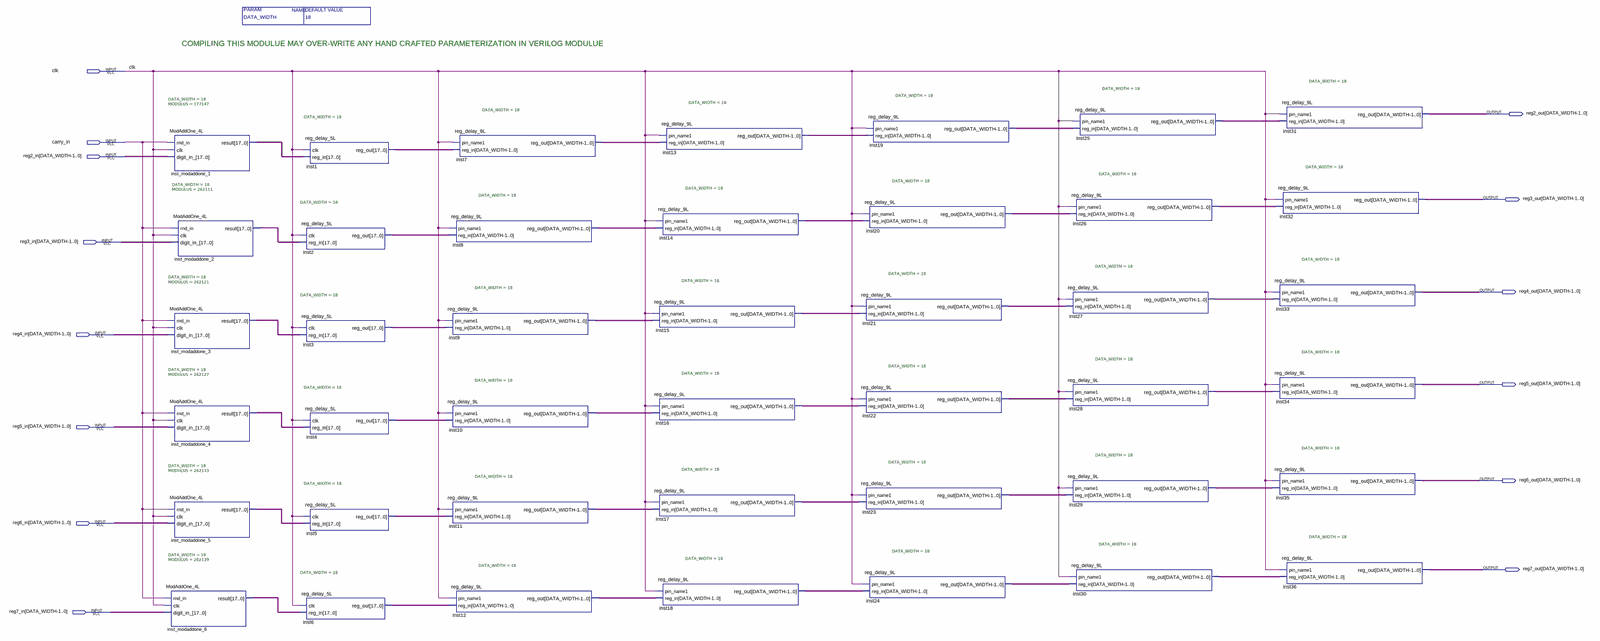
[diagram p0: schematic sheet, whole]
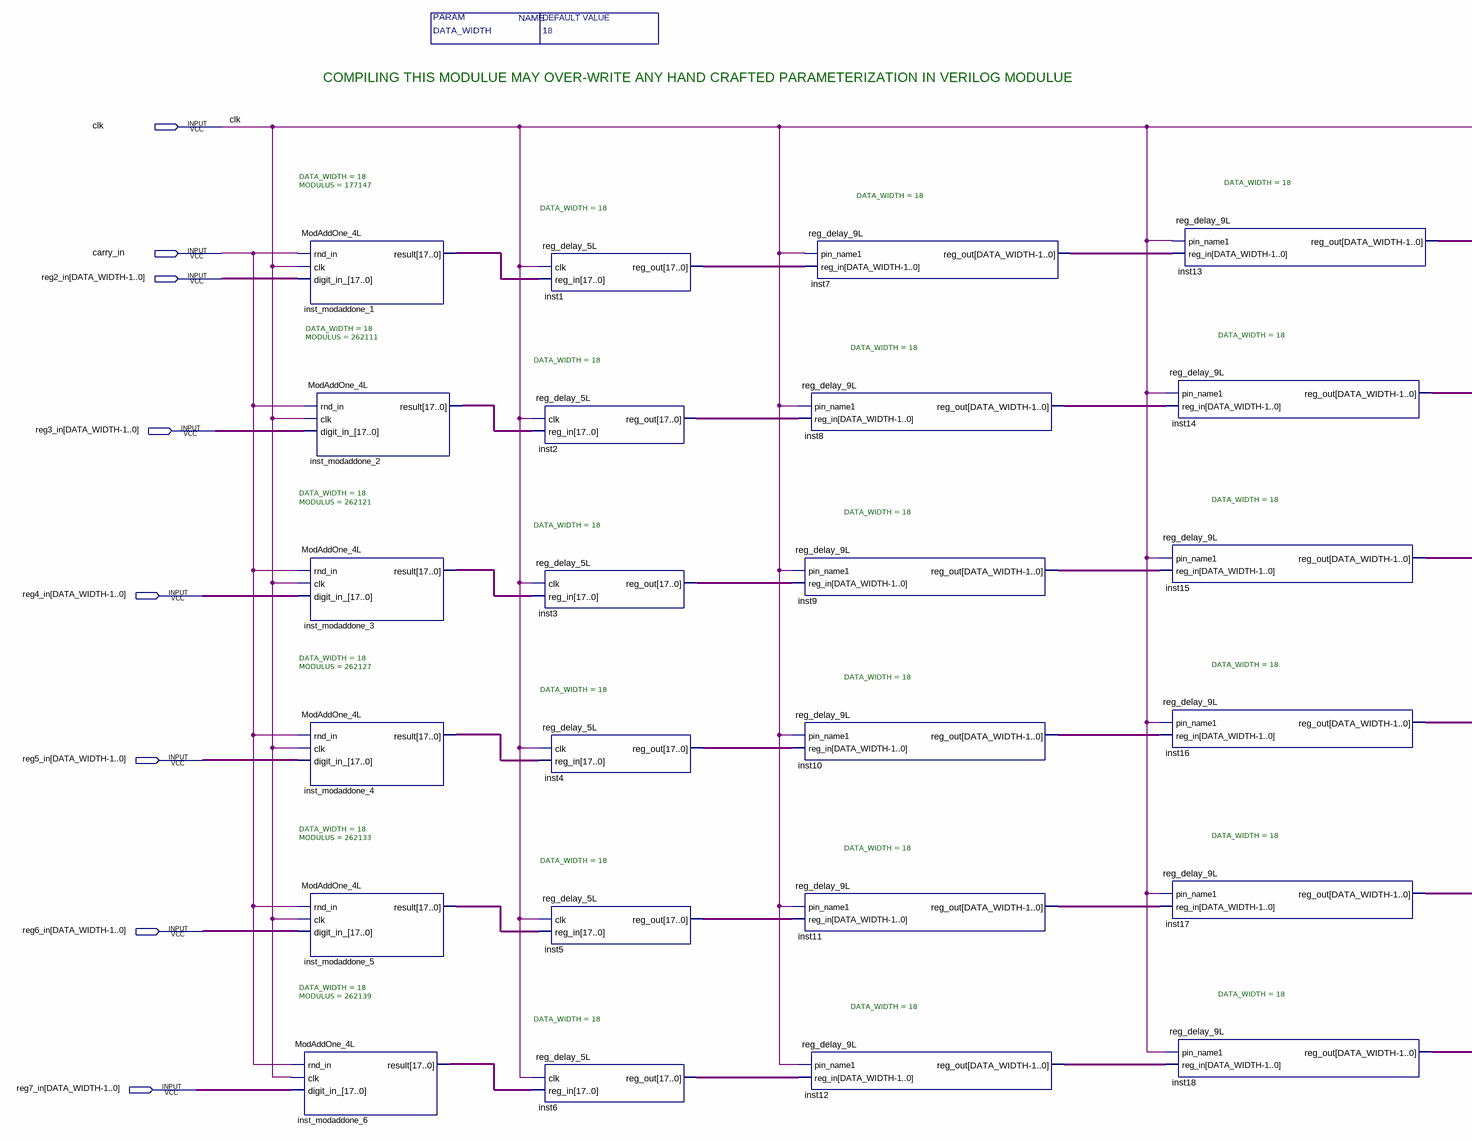
[diagram p1: schematic sheet, left part]
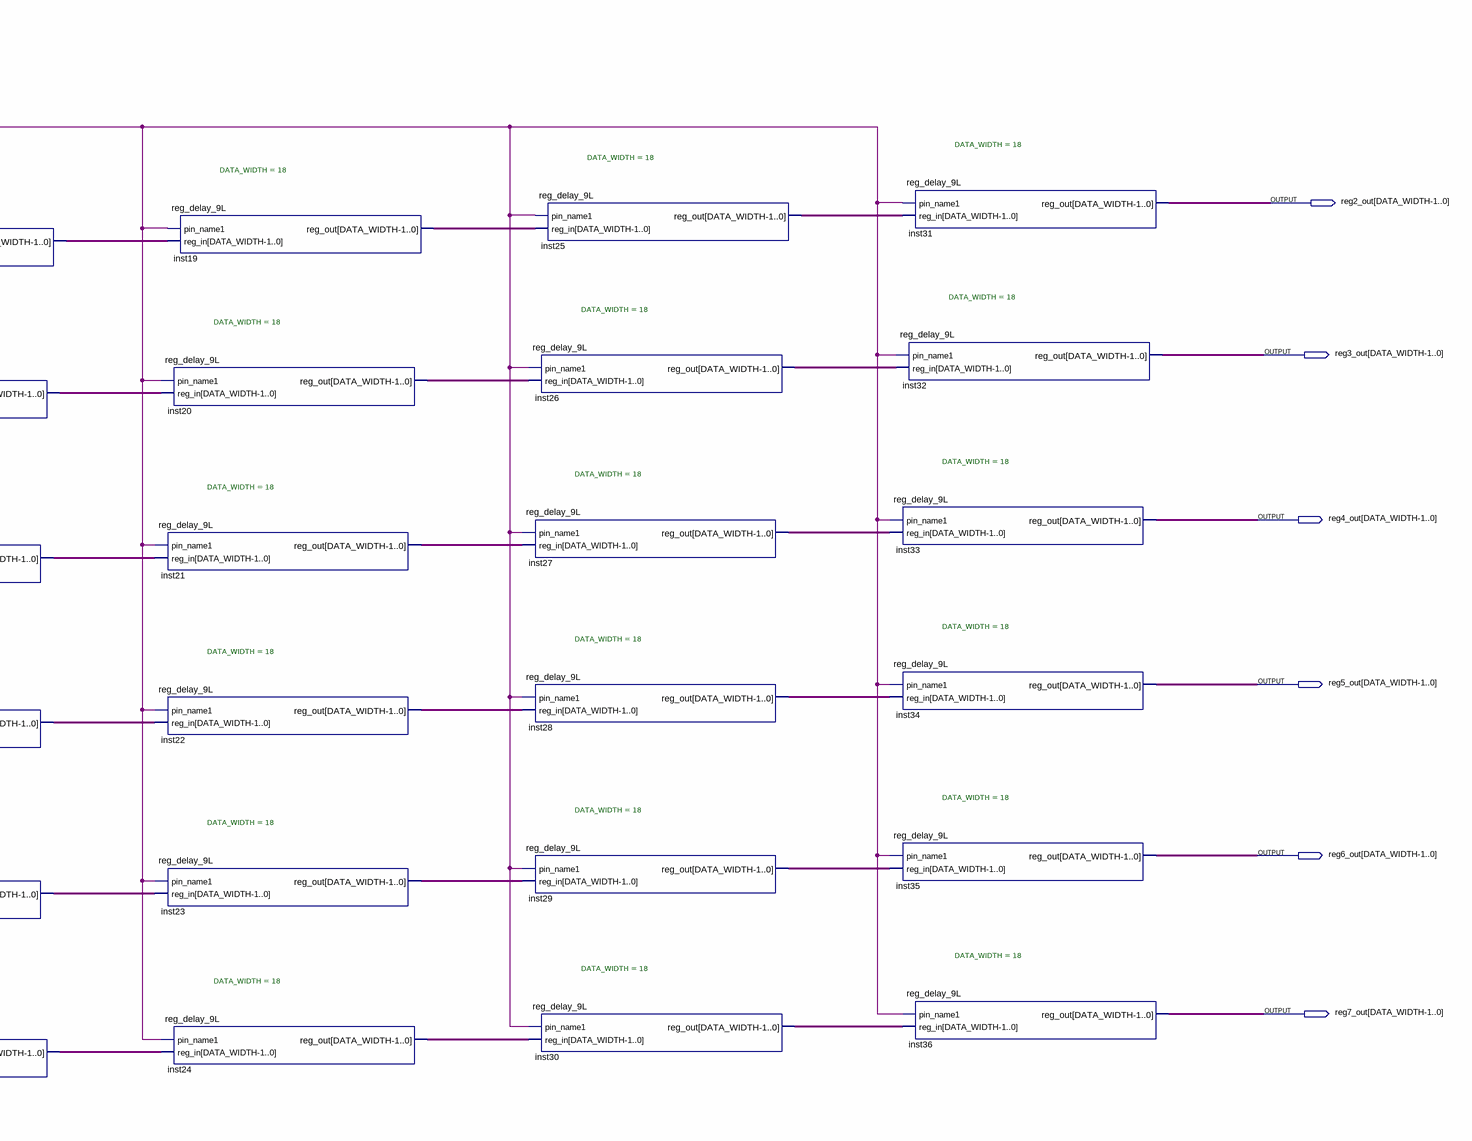
[diagram p2: schematic sheet, right part]
// Quartus schematic reg_delay_addone_9L_x6.bdf as structural Verilog: 42 symbols, 14 pins
module reg_delay_addone_9L_x6 #(parameter DATA_WIDTH = 18) (
  input  clk,
  input  carry_in,
  input  [17:0] reg2_in,
  input  [17:0] reg3_in,
  input  [17:0] reg4_in,
  input  [17:0] reg5_in,
  input  [17:0] reg6_in,
  input  [17:0] reg7_in,
  output [17:0] reg2_out,
  output [17:0] reg3_out,
  output [17:0] reg4_out,
  output [17:0] reg5_out,
  output [17:0] reg6_out,
  output [17:0] reg7_out
);

  wire [17:0] inst1_reg_out, inst2_reg_out, inst3_reg_out, inst4_reg_out, inst5_reg_out, inst6_reg_out,
       inst7_reg_out, inst8_reg_out, inst9_reg_out, inst10_reg_out, inst11_reg_out, inst12_reg_out,
       inst13_reg_out, inst14_reg_out, inst15_reg_out, inst16_reg_out, inst17_reg_out, inst18_reg_out,
       inst19_reg_out, inst20_reg_out, inst21_reg_out, inst22_reg_out, inst23_reg_out, inst24_reg_out,
       inst25_reg_out, inst26_reg_out, inst27_reg_out, inst28_reg_out, inst29_reg_out, inst30_reg_out,
       inst_modaddone_1_result, inst_modaddone_2_result, inst_modaddone_3_result, inst_modaddone_4_result,
       inst_modaddone_5_result, inst_modaddone_6_result;

  ModAddOne_4L #(.DATA_WIDTH(18), .MODULUS(177147)) inst_modaddone_1 (
    .rnd_in(carry_in), .clk(clk), .digit_in_(reg2_in), .result(inst_modaddone_1_result));
  ModAddOne_4L #(.DATA_WIDTH(18), .MODULUS(262111)) inst_modaddone_2 (
    .rnd_in(carry_in), .clk(clk), .digit_in_(reg3_in), .result(inst_modaddone_2_result));
  ModAddOne_4L #(.DATA_WIDTH(18), .MODULUS(262121)) inst_modaddone_3 (
    .rnd_in(carry_in), .clk(clk), .digit_in_(reg4_in), .result(inst_modaddone_3_result));
  ModAddOne_4L #(.DATA_WIDTH(18), .MODULUS(262127)) inst_modaddone_4 (
    .rnd_in(carry_in), .clk(clk), .digit_in_(reg5_in), .result(inst_modaddone_4_result));
  ModAddOne_4L #(.DATA_WIDTH(18), .MODULUS(262133)) inst_modaddone_5 (
    .rnd_in(carry_in), .clk(clk), .digit_in_(reg6_in), .result(inst_modaddone_5_result));
  ModAddOne_4L #(.DATA_WIDTH(18), .MODULUS(262139)) inst_modaddone_6 (
    .rnd_in(carry_in), .clk(clk), .digit_in_(reg7_in), .result(inst_modaddone_6_result));
  reg_delay_5L #(.DATA_WIDTH(18)) inst1 (.clk(clk), .reg_in(inst_modaddone_1_result), .reg_out(inst1_reg_out));
  reg_delay_5L #(.DATA_WIDTH(18)) inst2 (.clk(clk), .reg_in(inst_modaddone_2_result), .reg_out(inst2_reg_out));
  reg_delay_5L #(.DATA_WIDTH(18)) inst3 (.clk(clk), .reg_in(inst_modaddone_3_result), .reg_out(inst3_reg_out));
  reg_delay_5L #(.DATA_WIDTH(18)) inst4 (.clk(clk), .reg_in(inst_modaddone_4_result), .reg_out(inst4_reg_out));
  reg_delay_5L #(.DATA_WIDTH(18)) inst5 (.clk(clk), .reg_in(inst_modaddone_5_result), .reg_out(inst5_reg_out));
  reg_delay_5L #(.DATA_WIDTH(18)) inst6 (.clk(clk), .reg_in(inst_modaddone_6_result), .reg_out(inst6_reg_out));
  reg_delay_9L #(.DATA_WIDTH(18)) inst7 (.pin_name1(clk), .reg_in(inst1_reg_out), .reg_out(inst7_reg_out));
  reg_delay_9L #(.DATA_WIDTH(18)) inst8 (.pin_name1(clk), .reg_in(inst2_reg_out), .reg_out(inst8_reg_out));
  reg_delay_9L #(.DATA_WIDTH(18)) inst9 (.pin_name1(clk), .reg_in(inst3_reg_out), .reg_out(inst9_reg_out));
  reg_delay_9L #(.DATA_WIDTH(18)) inst10 (.pin_name1(clk), .reg_in(inst4_reg_out), .reg_out(inst10_reg_out));
  reg_delay_9L #(.DATA_WIDTH(18)) inst11 (.pin_name1(clk), .reg_in(inst5_reg_out), .reg_out(inst11_reg_out));
  reg_delay_9L #(.DATA_WIDTH(18)) inst12 (.pin_name1(clk), .reg_in(inst6_reg_out), .reg_out(inst12_reg_out));
  reg_delay_9L #(.DATA_WIDTH(18)) inst14 (.pin_name1(clk), .reg_in(inst8_reg_out), .reg_out(inst14_reg_out));
  reg_delay_9L #(.DATA_WIDTH(18)) inst15 (.pin_name1(clk), .reg_in(inst9_reg_out), .reg_out(inst15_reg_out));
  reg_delay_9L #(.DATA_WIDTH(18)) inst16 (.pin_name1(clk), .reg_in(inst10_reg_out), .reg_out(inst16_reg_out));
  reg_delay_9L #(.DATA_WIDTH(18)) inst17 (.pin_name1(clk), .reg_in(inst11_reg_out), .reg_out(inst17_reg_out));
  reg_delay_9L #(.DATA_WIDTH(18)) inst18 (.pin_name1(clk), .reg_in(inst12_reg_out), .reg_out(inst18_reg_out));
  reg_delay_9L #(.DATA_WIDTH(18)) inst13 (.pin_name1(clk), .reg_in(inst7_reg_out), .reg_out(inst13_reg_out));
  reg_delay_9L #(.DATA_WIDTH(18)) inst19 (.pin_name1(clk), .reg_in(inst13_reg_out), .reg_out(inst19_reg_out));
  reg_delay_9L #(.DATA_WIDTH(18)) inst20 (.pin_name1(clk), .reg_in(inst14_reg_out), .reg_out(inst20_reg_out));
  reg_delay_9L #(.DATA_WIDTH(18)) inst21 (.pin_name1(clk), .reg_in(inst15_reg_out), .reg_out(inst21_reg_out));
  reg_delay_9L #(.DATA_WIDTH(18)) inst22 (.pin_name1(clk), .reg_in(inst16_reg_out), .reg_out(inst22_reg_out));
  reg_delay_9L #(.DATA_WIDTH(18)) inst23 (.pin_name1(clk), .reg_in(inst17_reg_out), .reg_out(inst23_reg_out));
  reg_delay_9L #(.DATA_WIDTH(18)) inst24 (.pin_name1(clk), .reg_in(inst18_reg_out), .reg_out(inst24_reg_out));
  reg_delay_9L #(.DATA_WIDTH(18)) inst25 (.pin_name1(clk), .reg_in(inst19_reg_out), .reg_out(inst25_reg_out));
  reg_delay_9L #(.DATA_WIDTH(18)) inst26 (.pin_name1(clk), .reg_in(inst20_reg_out), .reg_out(inst26_reg_out));
  reg_delay_9L #(.DATA_WIDTH(18)) inst27 (.pin_name1(clk), .reg_in(inst21_reg_out), .reg_out(inst27_reg_out));
  reg_delay_9L #(.DATA_WIDTH(18)) inst28 (.pin_name1(clk), .reg_in(inst22_reg_out), .reg_out(inst28_reg_out));
  reg_delay_9L #(.DATA_WIDTH(18)) inst29 (.pin_name1(clk), .reg_in(inst23_reg_out), .reg_out(inst29_reg_out));
  reg_delay_9L #(.DATA_WIDTH(18)) inst30 (.pin_name1(clk), .reg_in(inst24_reg_out), .reg_out(inst30_reg_out));
  reg_delay_9L #(.DATA_WIDTH(18)) inst31 (.pin_name1(clk), .reg_in(inst25_reg_out), .reg_out(reg2_out));
  reg_delay_9L #(.DATA_WIDTH(18)) inst32 (.pin_name1(clk), .reg_in(inst26_reg_out), .reg_out(reg3_out));
  reg_delay_9L #(.DATA_WIDTH(18)) inst33 (.pin_name1(clk), .reg_in(inst27_reg_out), .reg_out(reg4_out));
  reg_delay_9L #(.DATA_WIDTH(18)) inst34 (.pin_name1(clk), .reg_in(inst28_reg_out), .reg_out(reg5_out));
  reg_delay_9L #(.DATA_WIDTH(18)) inst35 (.pin_name1(clk), .reg_in(inst29_reg_out), .reg_out(reg6_out));
  reg_delay_9L #(.DATA_WIDTH(18)) inst36 (.pin_name1(clk), .reg_in(inst30_reg_out), .reg_out(reg7_out));

  // Notes on the sheet:
  //   COMPILING THIS MODULUE MAY OVER-WRITE ANY HAND CRAFTED PARAMETERIZATION IN VERILOG MODULUE
endmodule
